# EAGLE schematic PD (EAGLE 9.1.3)
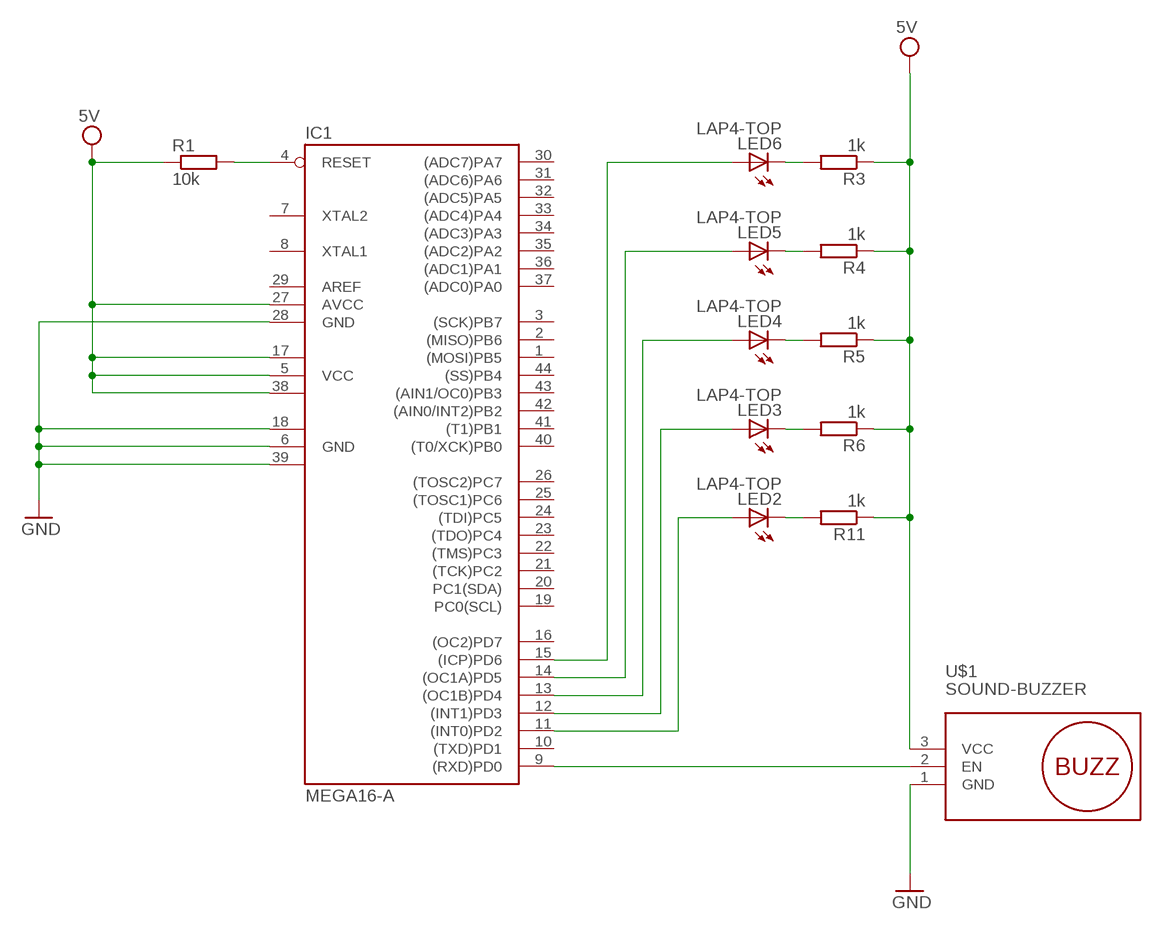
[diagram p0: schematic, sheet 1]

## Parts
IC1  MEGA16-A  [TQFP44]
LED2  LAP4-TOP  [P47F-TOP]
LED3  LAP4-TOP  [P47F-TOP]
LED4  LAP4-TOP  [P47F-TOP]
LED5  LAP4-TOP  [P47F-TOP]
LED6  LAP4-TOP  [P47F-TOP]
R1  10k  R-EU_M0805  [M0805]
R3  1k  R-EU_M0805  [M0805]
R4  1k  R-EU_M0805  [M0805]
R5  1k  R-EU_M0805  [M0805]
R6  1k  R-EU_M0805  [M0805]
R11  1k  R-EU_M0805  [M0805]
U$1  SOUND-BUZZER  [SOUND-BUZZER]

## Nets
GND: IC1.6(GND) IC1.18(GND1) IC1.28(GND) IC1.39(GND2) U$1.1(GND)
N$1: IC1.4(RESET) R1.2
N$2: IC1.9((RXD)PD0) U$1.2(EN)
N$3: LED4.C R5.2
N$23: IC1.15((ICP)PD6) LED6.A
N$24: IC1.14((OC1A)PD5) LED5.A
N$25: IC1.13((OC1B)PD4) LED4.A
N$26: IC1.12((INT1)PD3) LED3.A
N$27: IC1.11((INT0)PD2) LED2.A
N$28: LED2.C R11.2
N$29: LED3.C R6.2
N$30: LED6.C R3.2
N$31: LED5.C R4.2
VCC: IC1.5(VCC) IC1.17(VCC1) IC1.27(AVCC) IC1.38(VCC2) R1.1 R3.1 R4.1 R5.1 R6.1 R11.1 U$1.3(VCC) ; supply symbol labelled 5V
Unconnected: IC1.1((MOSI)PB5) IC1.2((MISO)PB6) IC1.3((SCK)PB7) IC1.7(XTAL2) IC1.8(XTAL1) IC1.10((TXD)PD1) IC1.16((OC2)PD7) IC1.19(PC0(SCL)) IC1.20(PC1(SDA)) IC1.21((TCK)PC2) IC1.22((TMS)PC3) IC1.23((TDO)PC4) IC1.24((TDI)PC5) IC1.25((TOSC1)PC6) IC1.26((TOSC2)PC7) IC1.29(AREF) IC1.30((ADC7)PA7) IC1.31((ADC6)PA6) IC1.32((ADC5)PA5) IC1.33((ADC4)PA4) IC1.34((ADC3)PA3) IC1.35((ADC2)PA2) IC1.36((ADC1)PA1) IC1.37((ADC0)PA0) IC1.40((T0/XCK)PB0) IC1.41((T1)PB1) IC1.42((AIN0/INT2)PB2) IC1.43((AIN1/OC0)PB3) IC1.44((SS)PB4)

## Library data of the parts
IC1 = atmel:MEGA16: MICROCONTROLLER 16 Kbytes FLASH 1 kbytes SRAM 512 bytes EEPROM USART 8-channel 10 bit ADC Source: avr.lbr; MPN: ATMEGA16-16AU; OC_FARNELL: 9171134; OC_NEWARK: 96K6515
LED2-LED6 = led:*P4: PointLED® Enhanced Thinfilm LED TOP & BOTTOM mount LS P47F, LR P47F, LA P47F, LY P47F, LT P4SG, LB P4SG, LW P4SG Source: http://catalog.osram-os.com .. LA_LR_LS_LY_P47F_Pb_free.pdf
R1 R3-R6 R11 = rcl:R-EU_: RESISTOR, European symbol; SPICEPREFIX: R
U$1 = diy-modules:SOUND-BUZZER: Sound Buzzer Module Click here to find device on ebay.com <http://www.ebay.com/sch/passive+buzzer+beep+module>